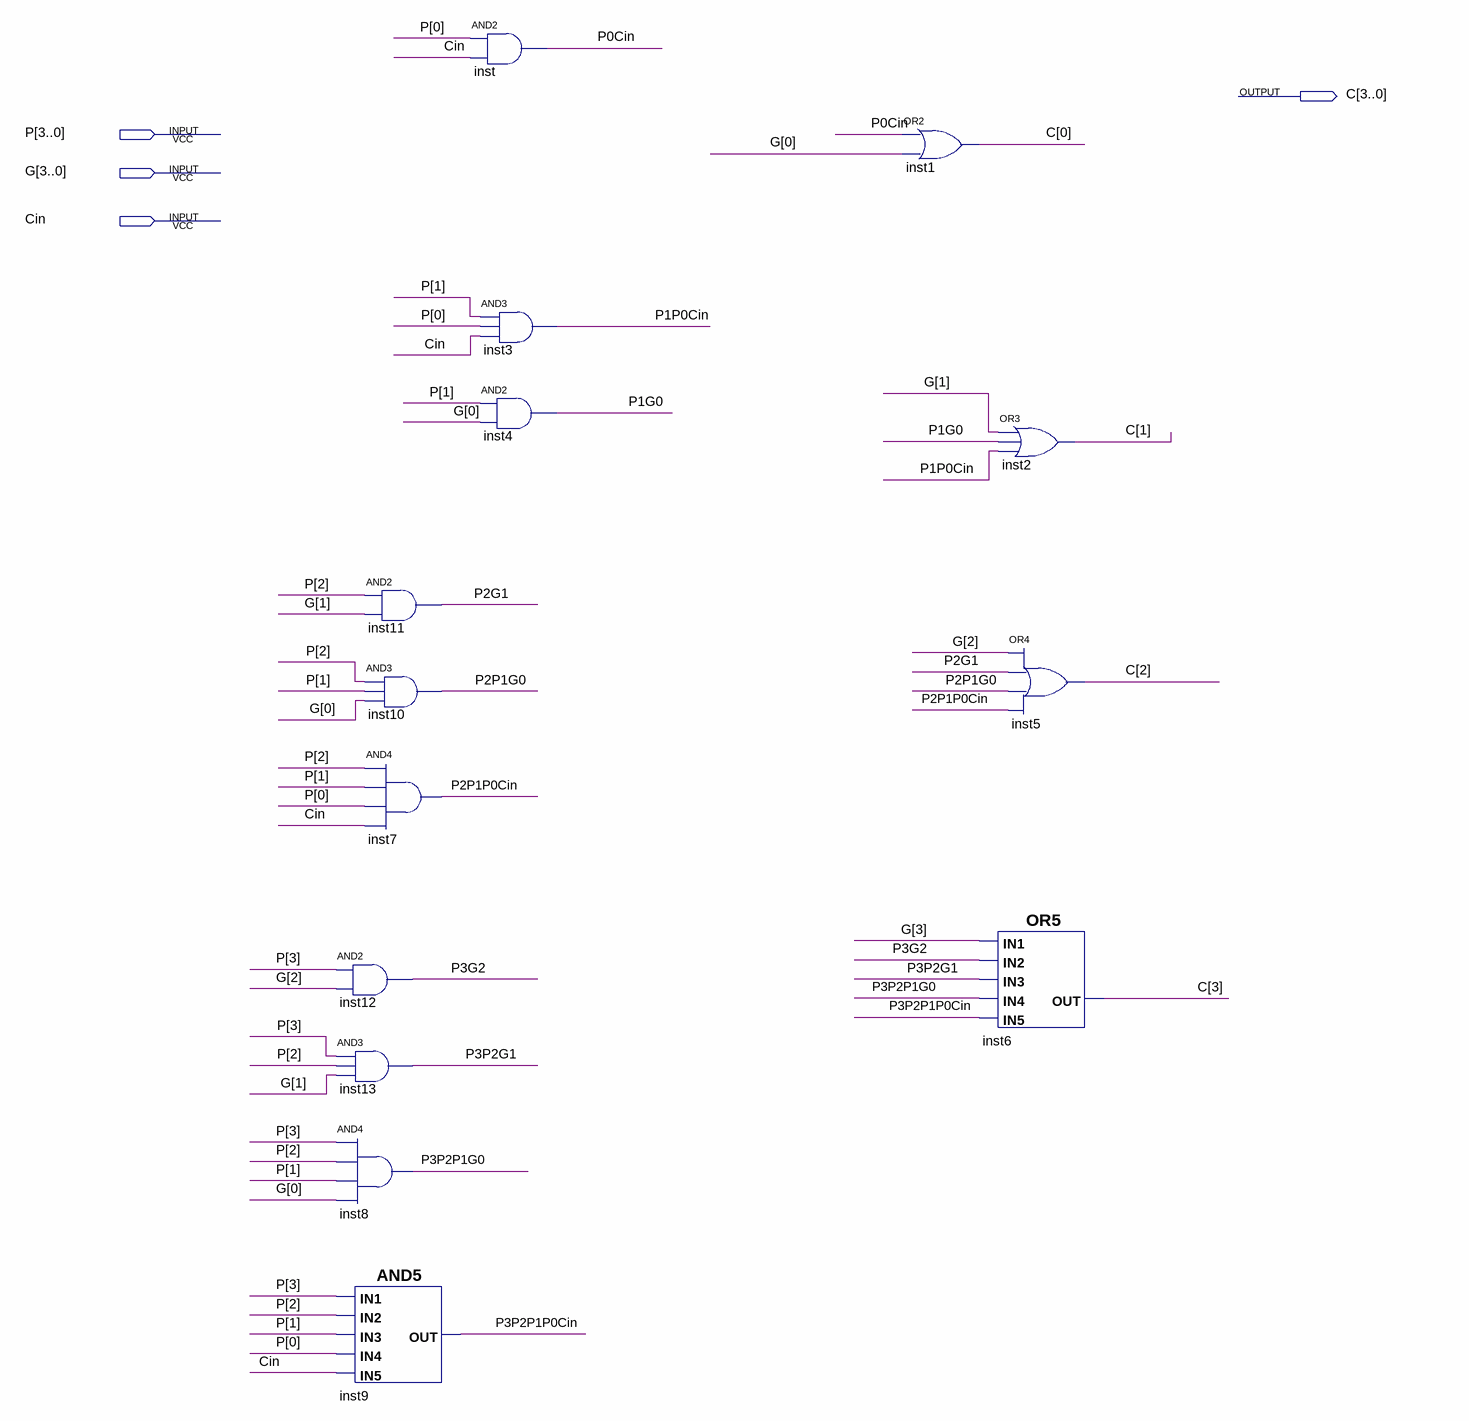
[diagram p0: schematic sheet]
// Quartus schematic CLAlogic.bdf as structural Verilog: 14 symbols, 4 pins
module CLAlogic (
  input  [3:0] P,
  input  [3:0] G,
  input  Cin,
  output [3:0] C
);

  wire P0Cin, P1G0, P1P0Cin, P2G1, P2P1G0, P2P1P0Cin, P3G2, P3P2G1, P3P2P1G0, P3P2P1P0Cin;

  and inst11 (P2G1, P[2], G[1]);
  and inst10 (P2P1G0, P[2], P[1], G[0]);
  and inst7 (P2P1P0Cin, P[2], P[1], P[0], Cin);
  and inst12 (P3G2, P[3], G[2]);
  and inst13 (P3P2G1, P[3], P[2], G[1]);
  and inst8 (P3P2P1G0, P[3], P[2], P[1], G[0]);
  and inst9 (P3P2P1P0Cin, P[3], P[2], P[1], P[0], Cin);
  and inst (P0Cin, P[0], Cin);
  and inst3 (P1P0Cin, P[1], P[0], Cin);
  and inst4 (P1G0, P[1], G[0]);
  or inst1 (C[0], P0Cin, G[0]);
  or inst2 (C[1], G[1], P1G0, P1P0Cin);
  or inst5 (C[2], G[2], P2G1, P2P1G0, P2P1P0Cin);
  or inst6 (C[3], G[3], P3G2, P3P2G1, P3P2P1G0, P3P2P1P0Cin);
endmodule
